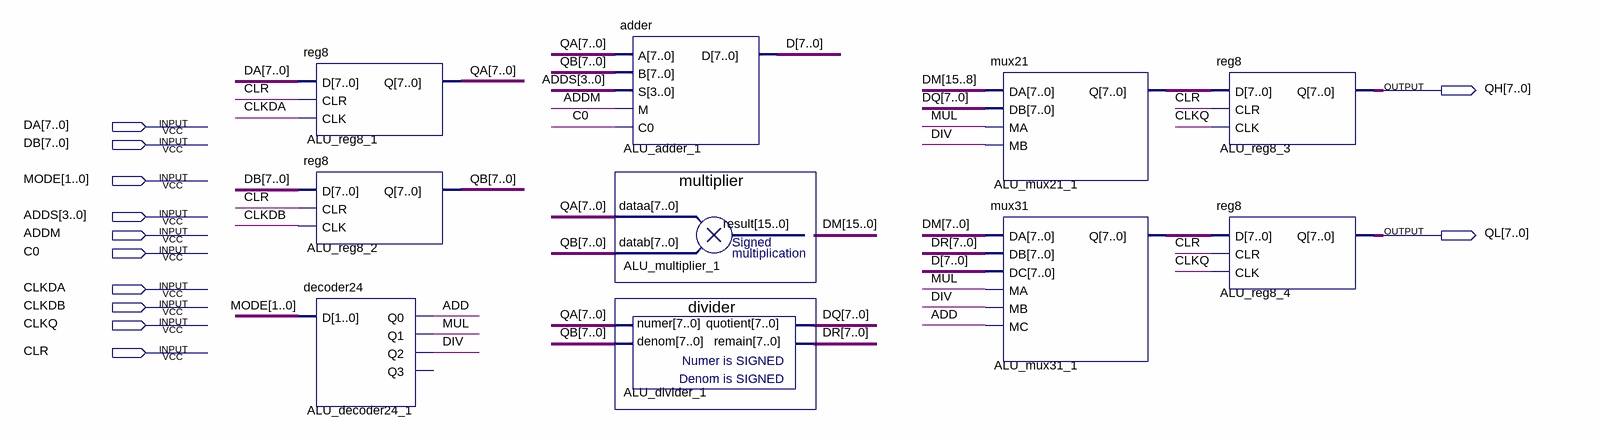
[diagram p0: schematic sheet]
// Quartus schematic ALU.bdf as structural Verilog: 10 symbols, 12 pins
module ALU (
  input  [7:0] DA,
  input  [7:0] DB,
  input  [1:0] MODE,
  input  [3:0] ADDS,
  input  ADDM,
  input  C0,
  input  CLKDA,
  input  CLKDB,
  input  CLKQ,
  input  CLR,
  output [7:0] QH,
  output [7:0] QL
);

  wire ADD, DIV, MUL;
  wire [7:0] ALU_mux21_1_q, ALU_mux31_1_q, D, DQ, DR, QA, QB;
  wire [15:0] DM;

  reg8 ALU_reg8_1 (.D(DA), .CLR(CLR), .CLK(CLKDA), .Q(QA));
  reg8 ALU_reg8_2 (.D(DB), .CLR(CLR), .CLK(CLKDB), .Q(QB));
  decoder24 ALU_decoder24_1 (.D(MODE), .Q0(ADD), .Q1(MUL), .Q2(DIV));  // open: Q3
  adder ALU_adder_1 (.A(QA), .B(QB), .S(ADDS), .M(ADDM), .C0(C0), .D(D));
  multiplier ALU_multiplier_1 (.dataa(QA), .datab(QB), .result(DM));
  divider ALU_divider_1 (.numer(QA), .denom(QB), .quotient(DQ), .remain(DR));
  mux21 ALU_mux21_1 (.DA(DM[15:8]), .DB(DQ), .MA(MUL), .MB(DIV), .Q(ALU_mux21_1_q));
  mux31 ALU_mux31_1 (.DA(DM[7:0]), .DB(DR), .DC(D), .MA(MUL), .MB(DIV), .MC(ADD), .Q(ALU_mux31_1_q));
  reg8 ALU_reg8_3 (.D(ALU_mux21_1_q), .CLR(CLR), .CLK(CLKQ), .Q(QH));
  reg8 ALU_reg8_4 (.D(ALU_mux31_1_q), .CLR(CLR), .CLK(CLKQ), .Q(QL));
endmodule
